# Altium schematic sheet Sheet1.SchDoc
size A4; SheetNumber: 1; SheetTotal: 1
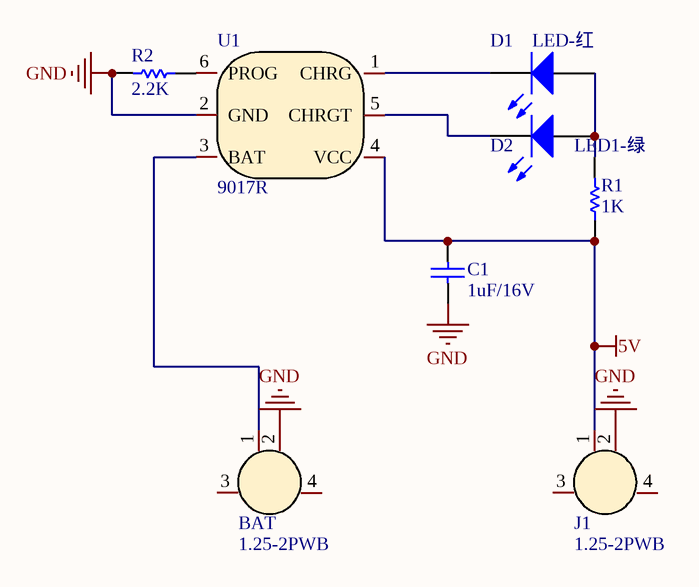
[diagram p0: Sheet1.SchDoc]

## Parts
BAT  1.25-2PWB  [MX 1.25-LS-2P]
C1  1uF/16V  [6-0805_M]
D1  LED-红  [LED0805-RD_GREEN]
D2  LED1-绿  [LED0805-RD_GREEN]
J1  1.25-2PWB  [MX 1.25-LS-2P]
R1  1K  [6-0805_M]
R2  2.2K  [6-0805_M]
U1  9017R

## Nets
5V: C1.2 J1.1 R1.1 U1.4(VCC)
GND: BAT.2 C1.1 J1.2 R2.2 U1.2(GND)
NetBAT_1: BAT.1 U1.3(BAT)
NetD1_1: D1.1(A) D2.1(A) R1.2
NetD1_2: D1.2(K) U1.1(CHRG)
NetD2_2: D2.2(K) U1.5(CHRGT)
NetR2_1: R2.1 U1.6(PROG)

Not connected (* = marked no-connect by the designer): BAT 3 4; J1 3 4

## Library data of the parts
C1 = Cap: Capacitor; Value: 100pF; Published: 8-Jun-2000; LatestRevisionDate: 17-Jul-2002; LatestRevisionNote: Re-released for DXP Platform.; PackageReference: RAD-0.3; Publisher: Altium Limited; PackageDescription: Radial Cap, Thru-Hole; 2 Leads; 0.3 in Pin Spacing
D1 D2 = LED1: Typical RED GaAs LED; Published: 8-Jun-2000; LatestRevisionDate: 08-Jul-2005; LatestRevisionNote: Mech Layer 1 removed.; PackageReference: LED-1; Publisher: Altium Limited; PackageDescription: LED; 2 Leads
R1 = Res1: Resistor; Published: 8-Jun-2000; LatestRevisionDate: 17-Jul-2002; LatestRevisionNote: Re-released for DXP Platform.; PackageReference: AXIAL-0.3; Publisher: Altium Limited; PackageDescription: Axial Device, Thru-Hole; 2 Leads; 0.3 in Pin Spacing; Value: 1K
R2 = Res1: Resistor; Value: 1K; Published: 8-Jun-2000; LatestRevisionDate: 17-Jul-2002; LatestRevisionNote: Re-released for DXP Platform.; PackageReference: AXIAL-0.3; Publisher: Altium Limited; PackageDescription: Axial Device, Thru-Hole; 2 Leads; 0.3 in Pin Spacing